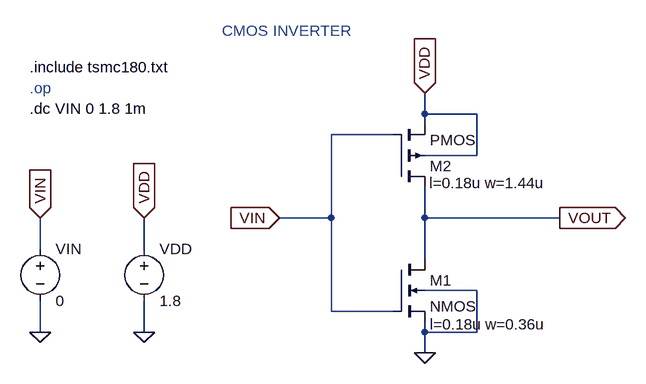
[diagram p0: schematic cmos_inverter.asc]
cmos_inverter.asc, the LTspice schematic file:
Version 4
SHEET 1 880 680
WIRE 320 64 320 32
WIRE 400 64 320 64
WIRE 320 80 320 64
WIRE 272 96 176 96
WIRE 400 128 400 64
WIRE 400 128 320 128
WIRE 176 224 176 96
WIRE 176 224 96 224
WIRE 320 224 320 176
WIRE 528 224 320 224
WIRE -272 272 -272 224
WIRE -112 272 -112 224
WIRE 320 288 320 224
WIRE 400 336 320 336
WIRE 176 368 176 224
WIRE 272 368 176 368
WIRE -272 400 -272 352
WIRE -112 400 -112 352
WIRE 320 400 320 384
WIRE 400 400 400 336
WIRE 400 400 320 400
WIRE 320 432 320 400
FLAG 528 224 VOUT
IOPIN 528 224 Out
FLAG 96 224 VIN
IOPIN 96 224 In
FLAG -272 224 VIN
IOPIN -272 224 In
FLAG -112 224 VDD
IOPIN -112 224 In
FLAG -112 400 0
FLAG -272 400 0
FLAG 320 432 0
FLAG 320 32 VDD
IOPIN 320 32 In
SYMBOL pmos4 272 176 M180
WINDOW 123 55 6 Left 2
SYMATTR InstName M2
SYMATTR Value2 l=0.18u w=1.44u
SYMBOL nmos4 272 288 R0
WINDOW 123 56 100 Left 2
SYMATTR InstName M1
SYMATTR Value2 l=0.18u w=0.36u
SYMBOL voltage -112 256 R0
WINDOW 123 0 0 Left 0
WINDOW 39 0 0 Left 0
SYMATTR InstName VDD
SYMATTR Value 1.8
SYMBOL voltage -272 256 R0
WINDOW 123 0 0 Left 0
WINDOW 39 0 0 Left 0
SYMATTR InstName VIN
SYMATTR Value 0
TEXT 8 -64 Left 2 ;CMOS INVERTER
TEXT -288 -8 Left 2 !.include tsmc180.txt
TEXT -288 24 Left 2 ;.op
TEXT -288 56 Left 2 !.dc VIN 0 1.8 1m

The netlist it stands for:
* cmos_inverter.asc
M2 VOUT VIN VDD VDD PMOS l=0.18u w=1.44u
M1 VOUT VIN 0 0 NMOS l=0.18u w=0.36u
VDD VDD 0 1.8
VIN VIN 0 0
.model NMOS NMOS
.model PMOS PMOS
.lib standard.mos
* CMOS INVERTER
.include tsmc180.txt
* .op
.dc VIN 0 1.8 1m
.backanno
.end